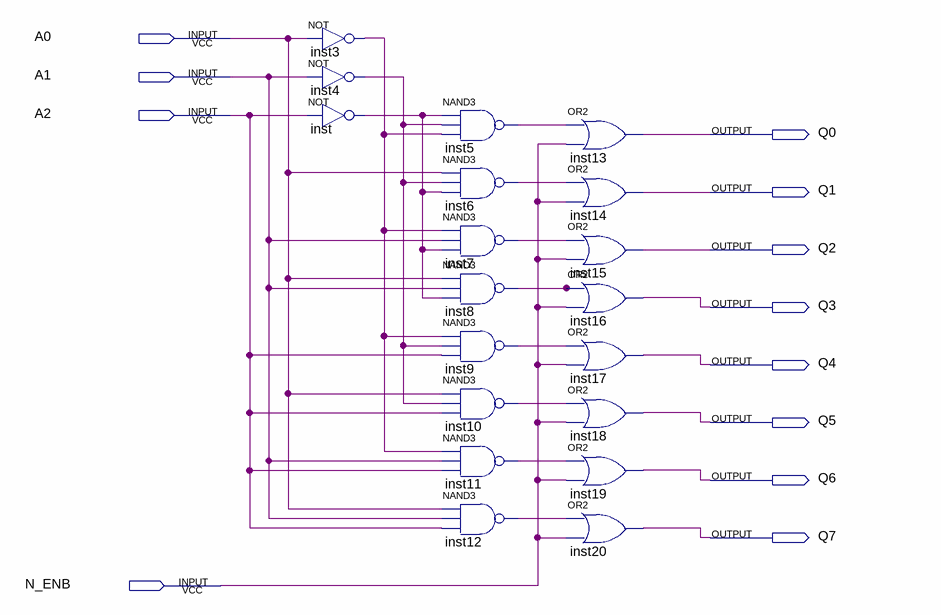
[diagram p0: schematic sheet]
// Quartus schematic DEMUL3_8_sch.bdf as structural Verilog: 19 symbols, 12 pins
module DEMUL3_8_sch (
  input  A0,
  input  A1,
  input  A2,
  input  N_ENB,
  output Q0,
  output Q1,
  output Q2,
  output Q3,
  output Q4,
  output Q5,
  output Q6,
  output Q7
);

  wire inst3_out, inst4_out, inst5_out, inst6_out, inst7_out, inst8_out, inst9_out, inst10_out, inst11_out,
       inst12_out, inst_out;

  not inst3 (inst3_out, A0);
  not inst4 (inst4_out, A1);
  not inst (inst_out, A2);
  nand inst5 (inst5_out, inst_out, inst4_out, inst3_out);
  nand inst6 (inst6_out, A0, inst4_out, inst_out);
  nand inst7 (inst7_out, inst3_out, A1, inst_out);
  nand inst8 (inst8_out, A0, A1, inst_out);
  nand inst9 (inst9_out, inst3_out, inst4_out, A2);
  nand inst10 (inst10_out, A0, inst4_out, A2);
  nand inst11 (inst11_out, inst3_out, A1, A2);
  nand inst12 (inst12_out, A0, A1, A2);
  or inst13 (Q0, inst5_out, N_ENB);
  or inst14 (Q1, inst6_out, N_ENB);
  or inst15 (Q2, inst7_out, N_ENB);
  or inst16 (Q3, inst8_out, N_ENB);
  or inst17 (Q4, inst9_out, N_ENB);
  or inst18 (Q5, inst10_out, N_ENB);
  or inst19 (Q6, inst11_out, N_ENB);
  or inst20 (Q7, inst12_out, N_ENB);
endmodule
